# EasyEDA Pro project intellectual_roaddeng.eprj

# Schematic Schematic1
Create Date: 2025-08-11; Page Name: P1; Project Name: intellectual_roaddeng; Schematic Name: Schematic1; Update Date: 2025-09-09; Company: 嘉立创EDA; Page Size: A4; Version: V1.0
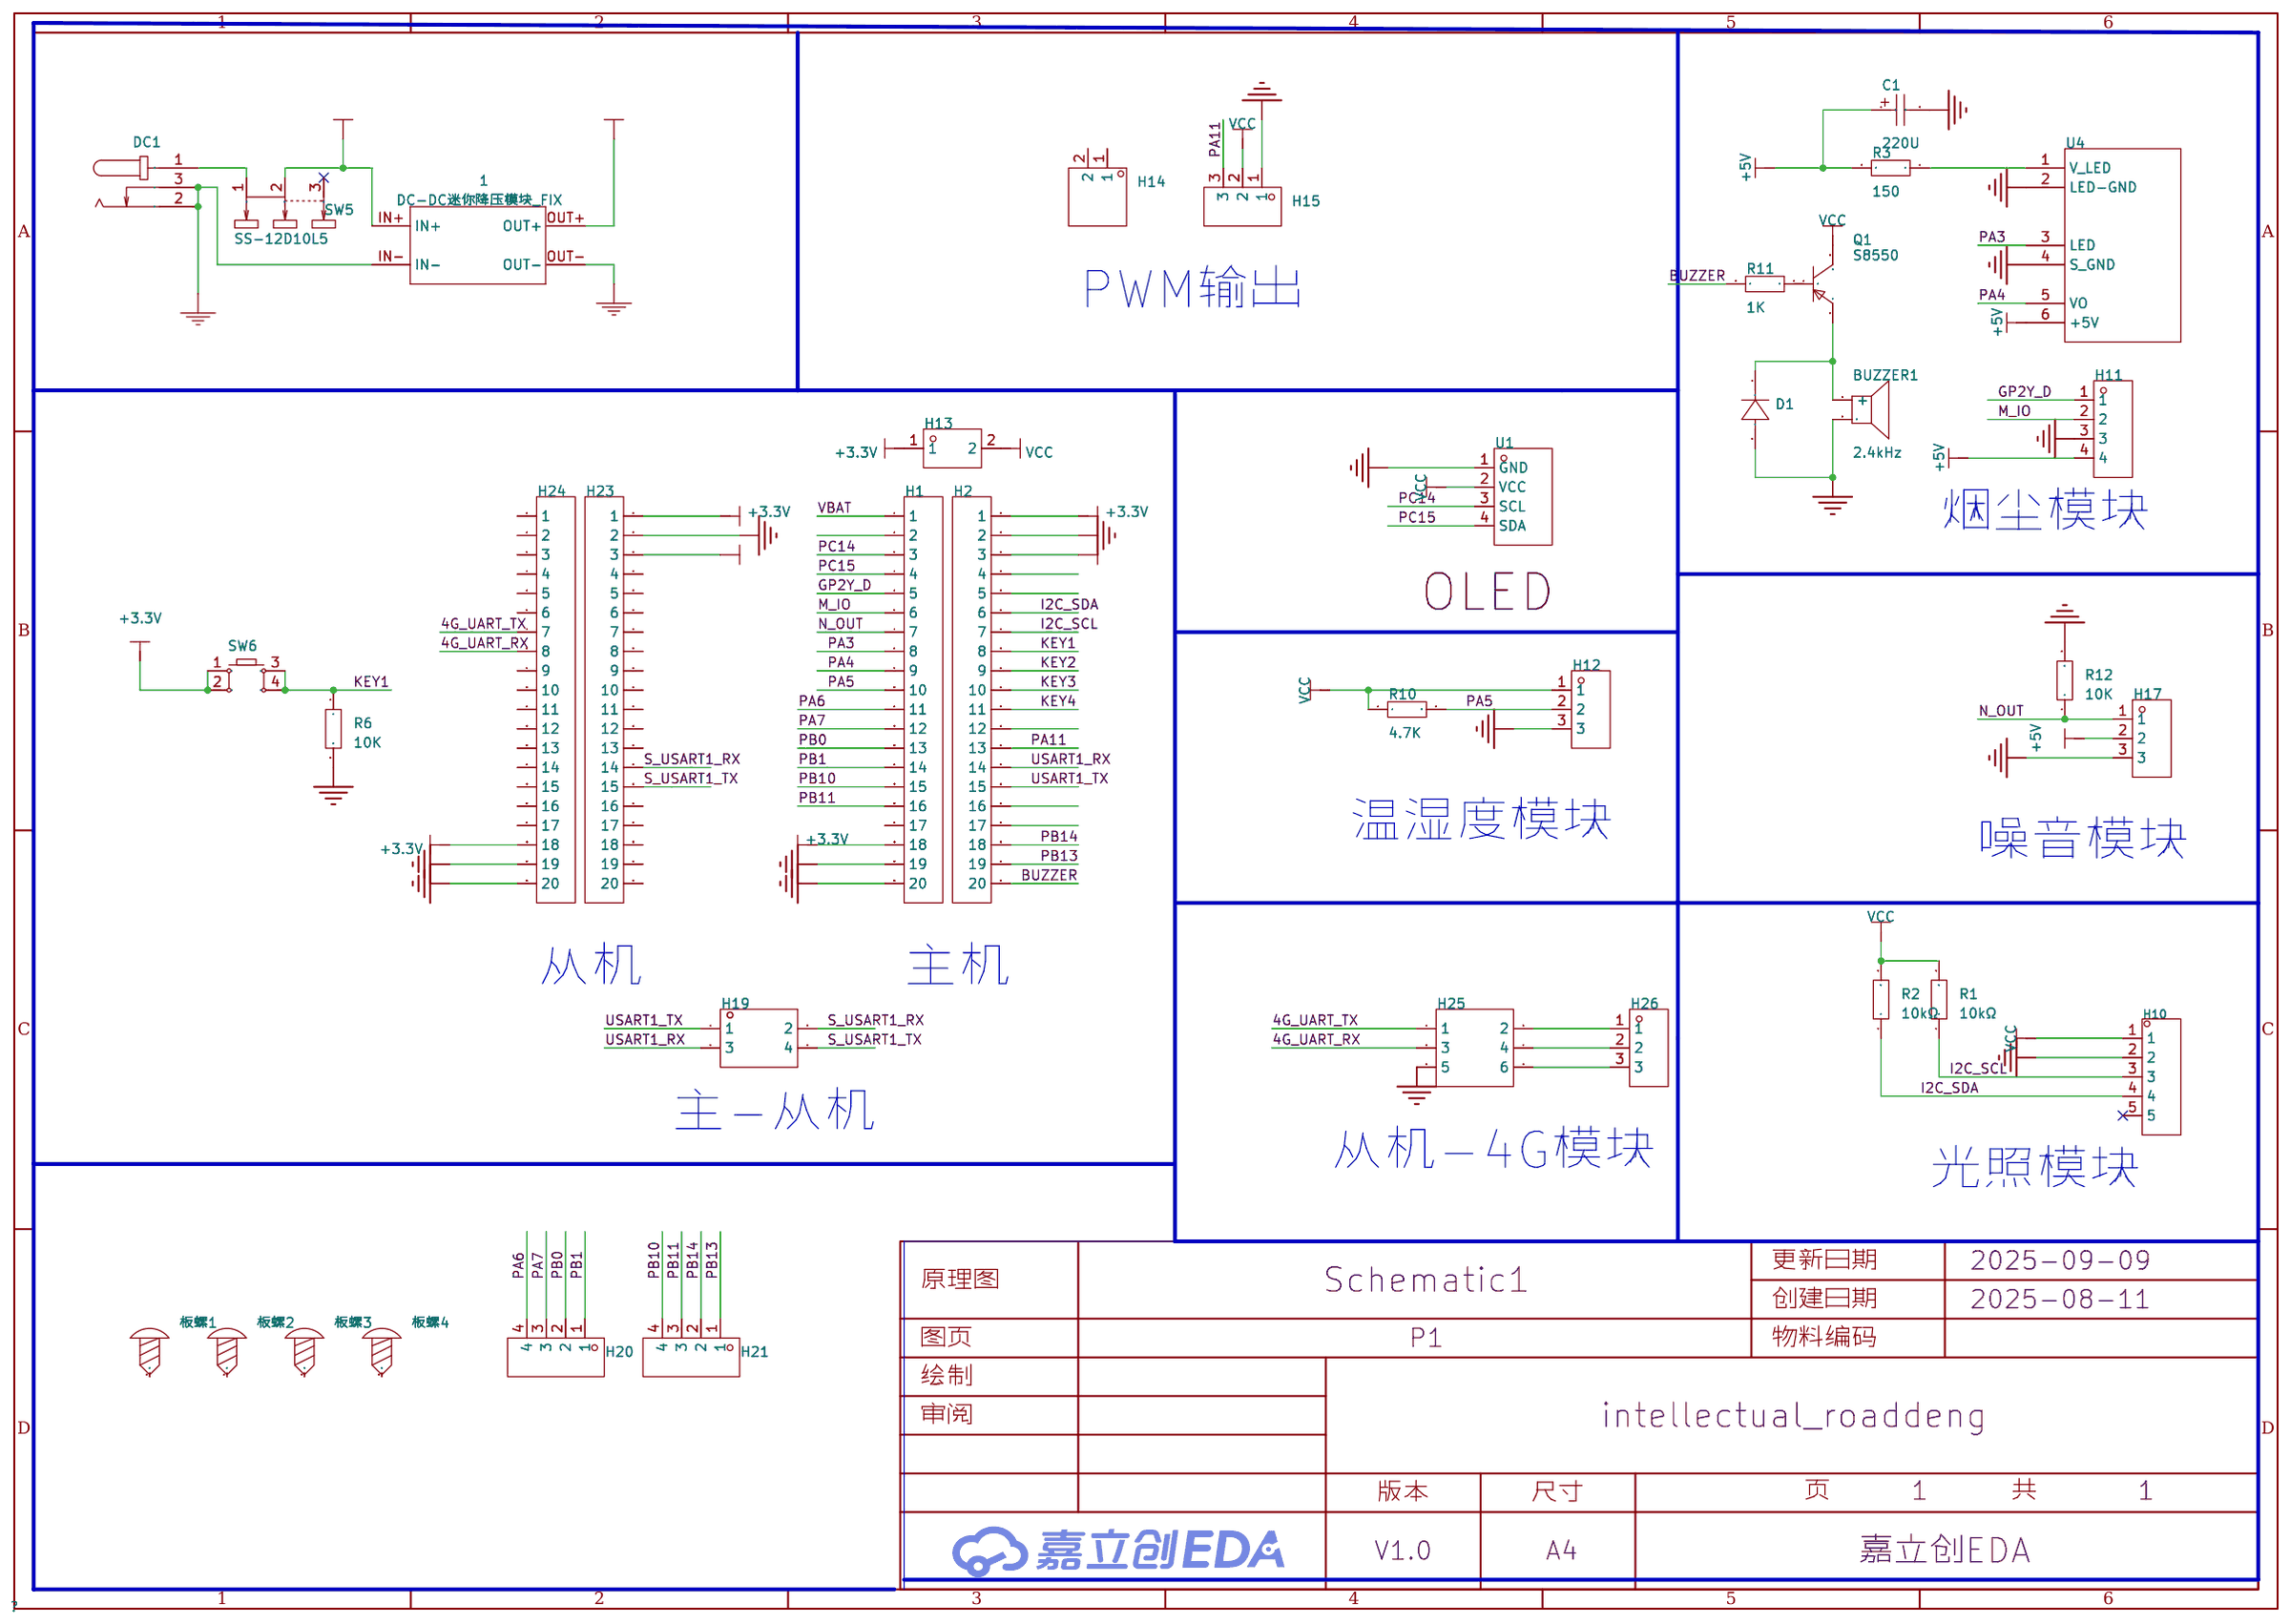
[diagram p0: schematic sheet]

## Parts
1  DC-DC迷你降压模块_FIX  [footprint_78bd]
BUZZER1  2.4kHz  [BUZ-TH_BD12.0-P7.60-D0.6-FD]
C1  220U  [CAP-TH-R3.51]
D1  -  [DO_1N4007]
DC1  DC005_C431533  [footprint_5569]
H1  HDR-F-2.54_1x20  [footprint_9e8e]
H2  HDR-F-2.54_1x20  [footprint_9e8e]
H10  -  [HDR-TH_5P-P2.54-V-M]
H11  -  [HDR-TH_4P-P2.54-V-F]
H12  -  [HDR-TH_3P-P2.54-V-F]
H13  -  [HDR-TH_2P-P2.54-V-M-2]
H14  -  [HDR-TH_2P-P2.54-V-M-1]
H15  -  [HDR-TH_3P-P2.54-V-M]
H17  -  [HDR-TH_3P-P2.54-V-F]
H19  -  [跳线帽连接器]
H20  -  [HDR-TH_4P-P2.54-V-F]
H21  -  [HDR-TH_4P-P2.54-V-F]
H23  HDR-F-2.54_1x20  [footprint_9e8e]
H24  HDR-F-2.54_1x20  [footprint_9e8e]
H25  -  [HDR-TH_6P-P2.54-V-F-R2-C3-S2.54]
H26  -  [HDR-TH_3P-P2.54-V-F]
Q1  S8550  [PNP-TH]
R1  10kΩ  [RES-TH_BD3.7-L10.7-P14.70-D0.4]
R2  10kΩ  [RES-TH_BD3.7-L10.7-P14.70-D0.4]
R3  150  [RES-TH_BD3.7-L10.7-P14.70-D0.4]
R6  10K  [RES-TH_BD3.7-L10.7-P14.70-D0.4]
R10  4.7K  [RES-TH_BD3.7-L10.7-P14.70-D0.4]
R11  1K  [RES-TH_BD3.7-L10.7-P14.70-D0.4]
R12  10K  [R0603]
SW5  SS-12D10L5  [footprint_fc91]
SW6  -  [KEY-TH]
U1  OLED  [OLED-TH_L27.8-W27.2-P2.54_C9900033791]
U4  -  [MX1.25-6P]
板螺1  -  [M2螺丝]
板螺2  -  [M2螺丝]
板螺3  -  [M2螺丝]
板螺4  -  [M2螺丝]

## Library data of the parts
1 = DC-DC迷你降压模块_FIX
BUZZER1 = TMB12A05_C96093: 驱动方式:有源(内含驱动线路);构造类型:电磁式;额定电压:-;频率:2.4kHz;声压(SPL):85dB;; LCSC Part Name: TMB12A05; Supplier Part: C96093; Manufacturer: 华能; Manufacturer Part: TMB12A05; Supplier Footprint: 插件,D=12mm; Datasheet: https://atta.szlcsc.com/upload/public/pdf/source/20241025/8A17FE04D767D19A35A06DEF9A82AB1E.pdf; Supplier: LCSC; Driver Circuitry: 有源(内含驱动线路); Technology: 电磁式; Voltage - Supply: 4V~8V; Sound Pressure Level(SPL): 85dB; Diameter(φD): 12mm; Height: 9.8mm
C1 = C_Ele_SMD_3x5.4mm: Supplier Footprint: SMD,3x5.4mm
D1 = D_1N4007A: Supplier Footprint: DO-41
DC1 = DC005_C431533: Supplier: LCSC; Supplier Part: C431533; Manufacturer: SHOU HAN; Manufacturer Part: DC005; JLCPCB Part Class: Extended Part
H1 H2 H23 H24 = HDR-F-2.54_1x20: Supplier Part: C50984; Supplier: LCSC; Manufacturer: BOOMELE; Manufacturer Part: 2.54mm 1*20P Female header
H10 = HDR-M_2.54_1x5P: Supplier Part: C358687; Supplier Footprint: 插件
H11 H20 H21 = HDR-F_2.54_1x4P: Supplier Part: C2718488; Supplier Footprint: 插件
H12 H17 H26 = HDR-F_2.54_1x3P: Supplier Part: C541850; Supplier Footprint: 插件
H13 = HDR-M_2.54_2x1: Supplier Part: C2883961; Supplier Footprint: 插件,P=2.54mm
H14 = HDR-M_2.54_1x2P: Supplier Part: C124375; Supplier Footprint: 插件
H15 = HDR-M_2.54_1x3P: Supplier Part: C2937625; Supplier Footprint: 插件
H19 = HDR-F_2.54_2x2: Supplier Part: C92273; Supplier Footprint: 插件
H25 = HDR-F_2.54_2x3: Supplier Part: C92272; Supplier Footprint: 插件
Q1 = S8550_C20069126: 晶体管类型:PNP;集电极电流(Ic):500mA;集射极击穿电压(Vceo):25V;耗散功率(Pd):300mW;直流电流增益(hFE):120@500mA,1.0V;; LCSC Part Name: hFE:200-350，丝印:2TY S8550; Supplier Part: C20069126; Manufacturer: 宏嘉诚; Supplier Footprint: SOT-23; Datasheet: https://atta.szlcsc.com/upload/public/pdf/source/20250107/6DAD7E9AA702AA129A4A0106BAAB5F5A.pdf; Supplier: LCSC; type: PNP; Current - Collector(Ic): 500mA; Collector - Emitter Voltage VCEO: 25V; Pd - Power Dissipation: 300mW; DC Current Gain: 120@500mA,1.0V; Transition frequency(fT): 150MHz; Current - Collector Cutoff: 100nA; Vce Saturation(VCE(sat)): 500mV; Operating Temperature: -55℃~+150℃
R1 R2 = Res_AXIAL-1/8W: Supplier Footprint: 轴向引线
R3 R6 R10-R12 = Res_0603: Supplier Footprint: 0603
SW5 = SS-12D10L5: Supplier: LCSC; Supplier Part: C319012; Manufacturer: XKB Enterprise; JLCPCB Part Class: Extended Part
SW6 = Key_SMD_12x12x7.3: Supplier Footprint: SMD
U1 = HS96L03W2C03: 主控芯片:SSD1315;接口类型:I2C;尺寸(inch):0.96;像素分辨率:128x64;; LCSC Part Name: 0.96寸OLED显示屏窄白光IIC; Supplier Part: C5248080; Manufacturer: HS(汉昇); Datasheet: https://atta.szlcsc.com/upload/public/pdf/source/20230627/763D01F79A90007632F098068C7C8AD9.pdf; Supplier: LCSC; Main Control Chip: SSD1315; Interface Type: I2C; Size: 0.96; Pixel Resolution: 128x64; Operating Temperature: -40℃~+70℃
U4 = GP2Y1014
板螺1-板螺4 = M2螺丝: Supplier Footprint: 插件

## Nets
+3.3V: H1.18 H2.1 H13.1 H23.1 H24.18 SW6.1 SW6.2
+5V: 1.OUT+ C1.1 H2.3 H11.4 H17.2 H23.3 R3.2 U4.6(+5V)
GND: 1.IN- 1.OUT- BUZZER1.2 C1.2 D1.2(A) DC1.2 DC1.3 H1.19 H1.20 H2.2 H10.2 H11.3 H12.3 H15.1 H17.3 H23.2 H24.19 H24.20 H25.5 R6.2 R12.2 U1.1(GND) U4.2(LED-GND) U4.4(S_GND)
VBAT: H1.1
VBAT_IN: 1.IN+ SW5.2
VCC: H10.1 H12.1 H13.2 H15.2 Q1.3(C) R1.2 R2.2 R10.1 U1.2(VCC)
4G_UART_RX: H24.8 H25.3
4G_UART_TX: H24.7 H25.1
BUZZER: H2.20 R11.2
GP2Y_D: H1.5 H11.1
I2C_SCL: H2.7 H10.3 R1.1
I2C_SDA: H2.6 H10.4 R2.1
KEY1: H2.8 R6.1 SW6.3 SW6.4
KEY2: H2.9
KEY3: H2.10
KEY4: H2.11
M_IO: H1.6 H11.2
N_OUT: H1.7 H17.1 R12.1
PA3: H1.8 U4.3(LED)
PA4: H1.9 U4.5(VO)
PA5: H1.10 H12.2 R10.2
PA6: H1.11 H20.4
PA7: H1.12 H20.3
PA11: H2.13 H15.3
PB0: H1.13 H20.2
PB1: H1.14 H20.1
PB10: H1.15 H21.4
PB11: H1.16 H21.3
PB13: H2.19 H21.1
PB14: H2.18 H21.2
PC14: H1.3 U1.3(SCL)
PC15: H1.4 U1.4(SDA)
S_USART1_RX: H19.2 H23.14
S_USART1_TX: H19.4 H23.15
USART1_RX: H2.14 H19.3
USART1_TX: H2.15 H19.1
$1N472: DC1.1 SW5.1
$1N3550: R3.1 U4.1(V_LED)
$1N3959: BUZZER1.1(+) D1.1(K) Q1.2(E)
$1N3998: Q1.1(B) R11.1
$1N9228: H25.2 H26.1
$1N9231: H25.4 H26.2
$1N9234: H25.6 H26.3

Not connected (* = marked no-connect by the designer): H1 2 17; H2 4 5 12 16 17; H10 5*; H14 1 2; H23 4 5 6 7 8 9 10 11 12 13 16 17 18 19 20; H24 1 2 3 4 5 6 9 10 11 12 13 14 15 16 17; SW5 3*; 板螺1 1; 板螺2 1; 板螺3 1; 板螺4 1

## Notes on the sheet
- PWM输出
- 烟尘模块
- 温湿度模块
- 噪音模块
- 从机
- 主机
- 主-从机
- 从机-4G模块
- 光照模块

# Board PCB1
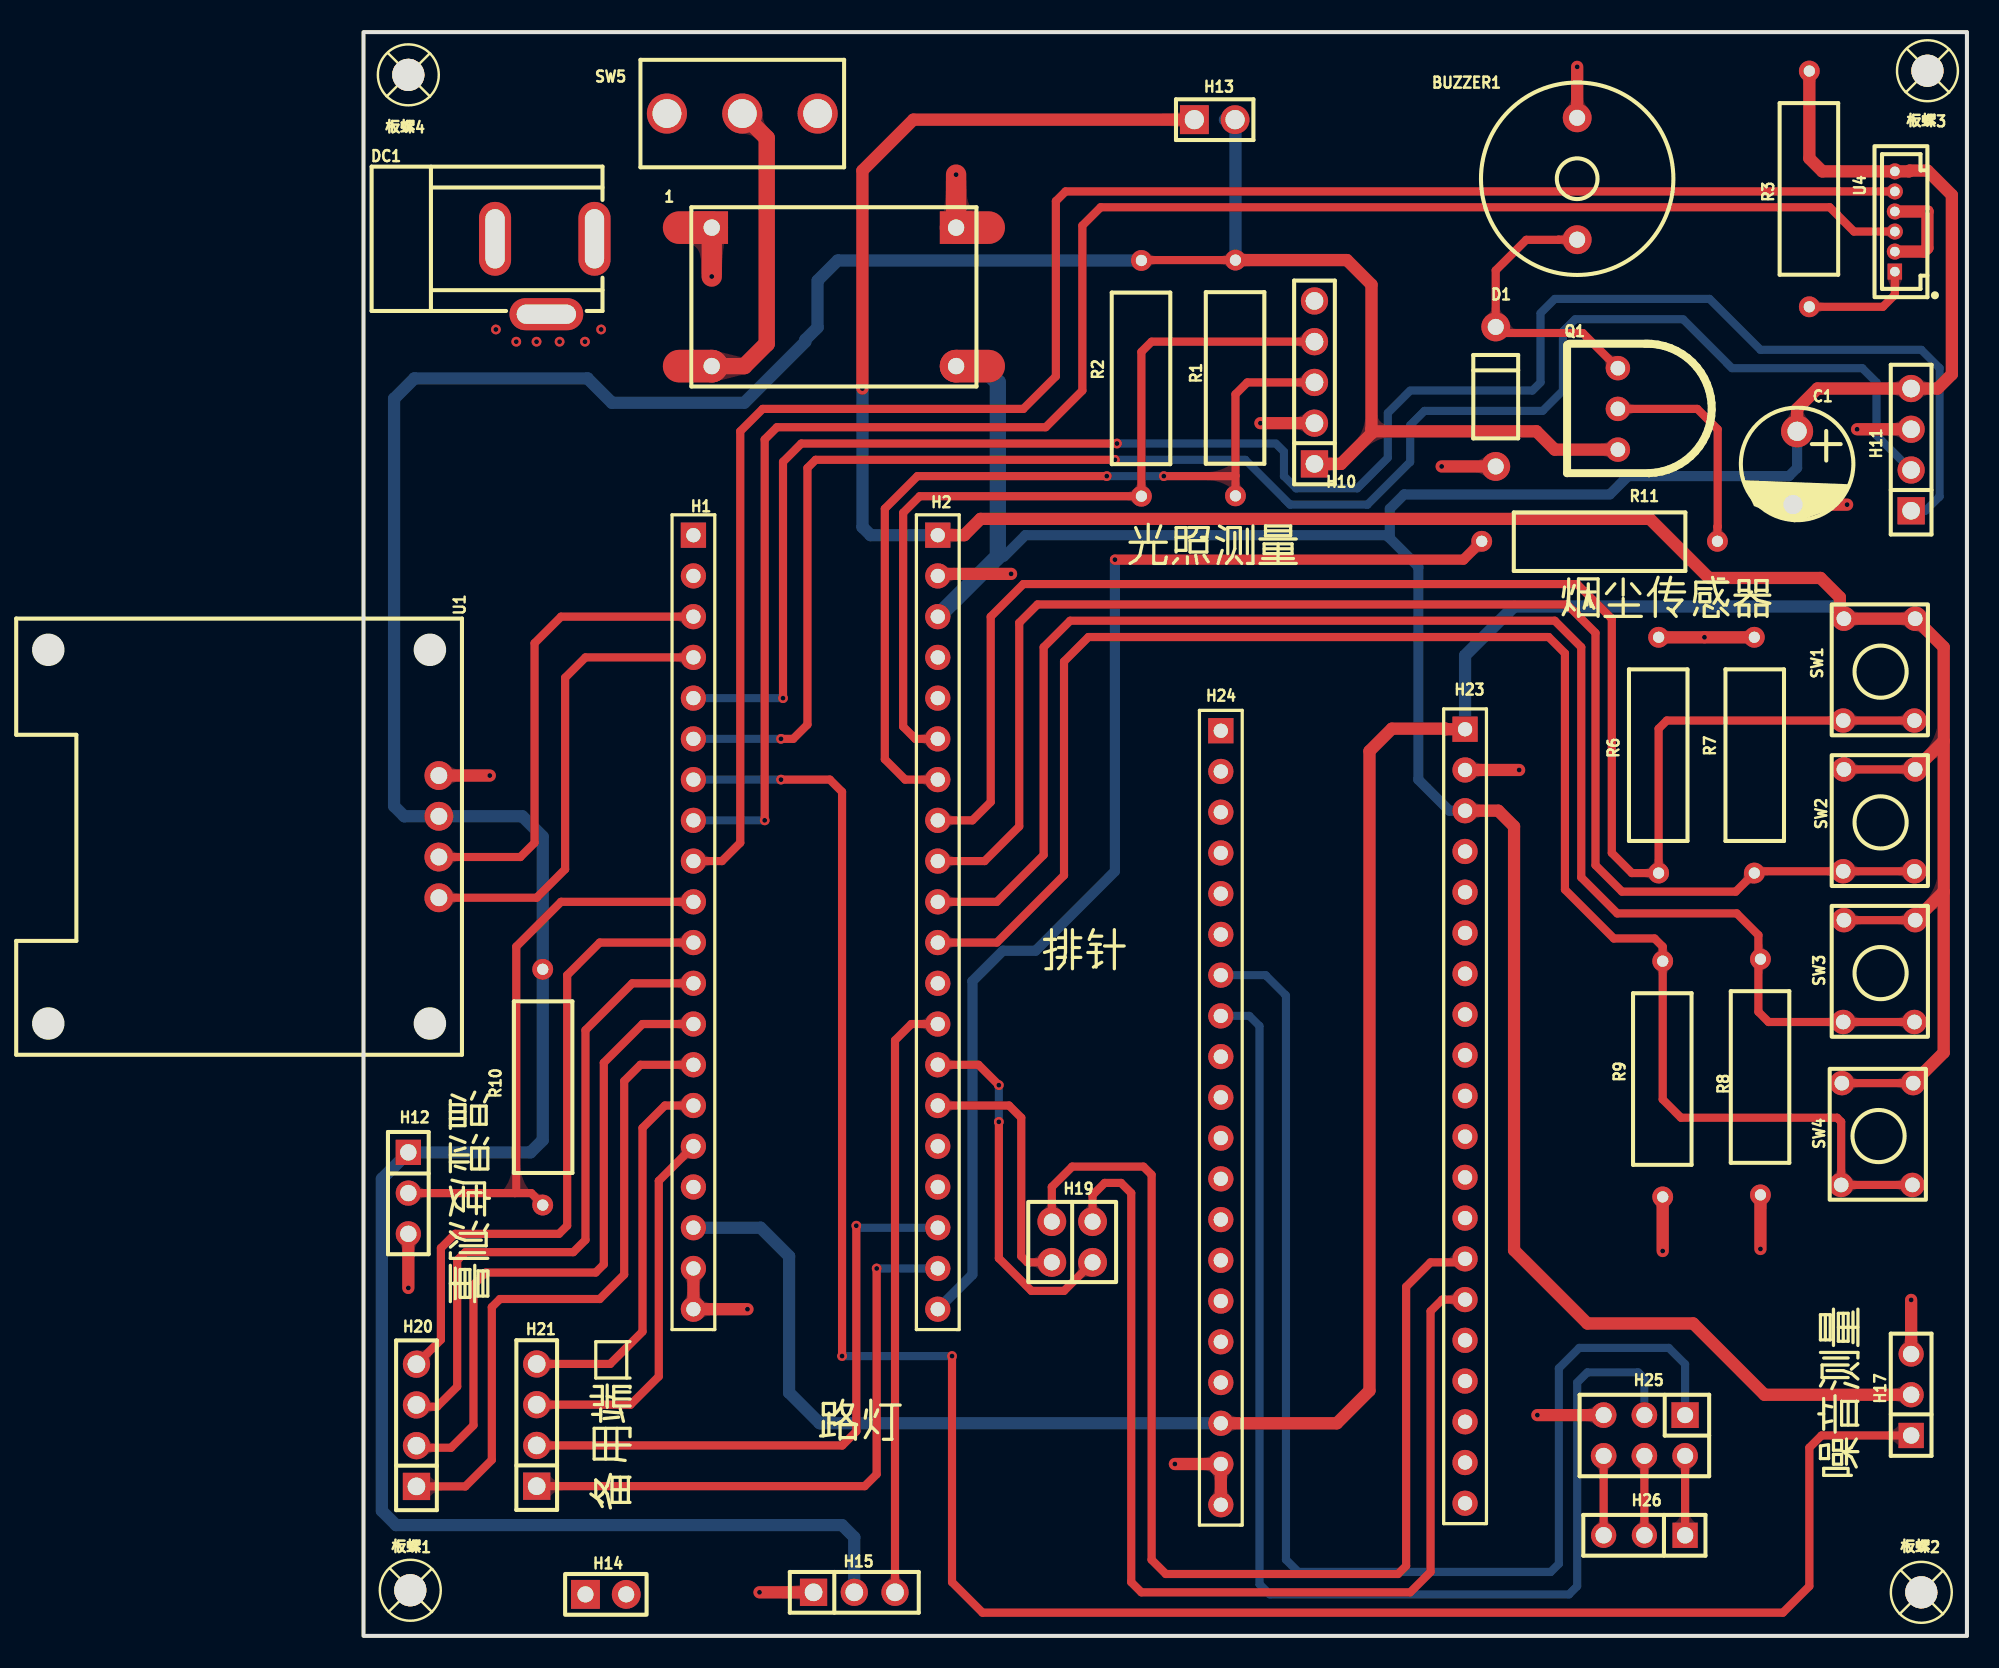
[diagram p1: board, top side]
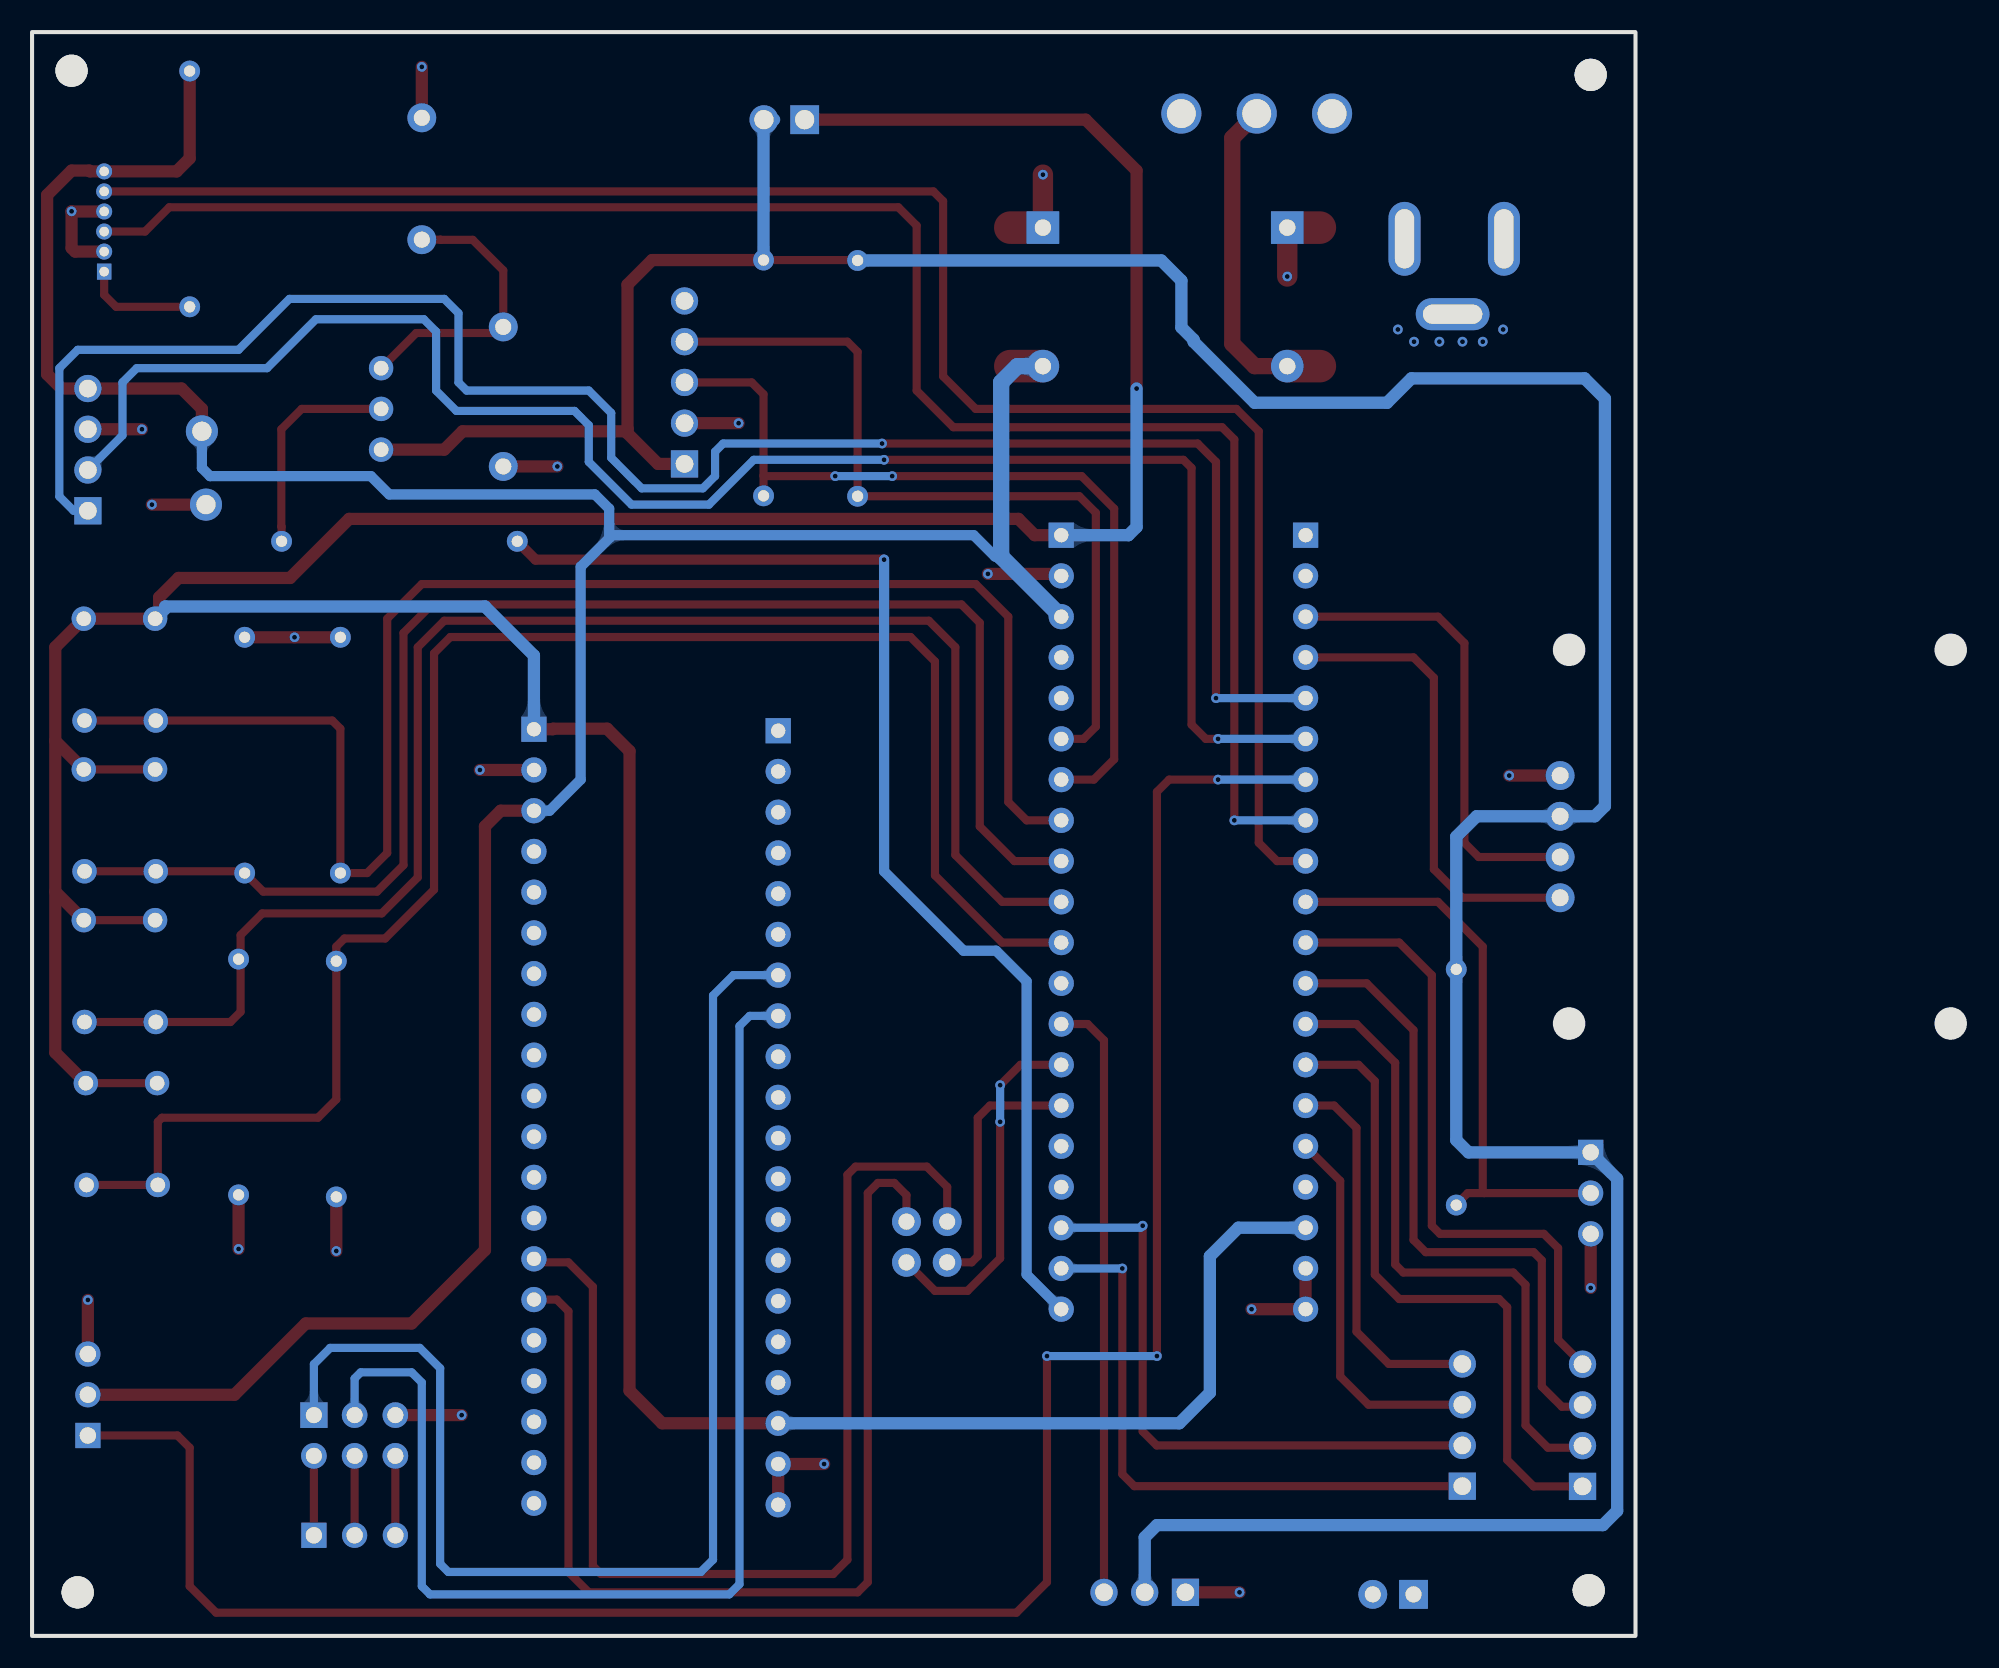
[diagram p2: board, bottom side, seen from below]

Outline 120.67 x 100 mm; copper layers: Top Layer, Bottom Layer. Coordinates in mm from the lower left corner of the outline.
Outline path: rectangle 20.67,100 120.67,0
Stack: Top Layer 0.035mm / Dielectric1 1.51mm FR4 er 4.5 / Bottom Layer 0.035mm

## Design rules (mm)
template: 自定义配置
spacing copperThickness1oz (default): track to track 0.254, other pairs 0.124 to 0.3
spacing copperThickness2oz: track to track 0.203, other pairs 0.152 to 0.3
track width copperThickness1oz (default): min 0.254, default 0.508, max 1.27
track width copperThickness2oz: min 0.203, default 0.254, max 2.54
differential pair differentialPair (default): width min 0.127, default 0.254, max 2.54; gap min 0.152, default 0.152
via viaSize (default): diameter min 0.5, default 0.61, max 10; hole min 0.3, default 0.305, max 6.299
net GND uses copperRegion1
net $1N472 uses copperRegion1

## Placement (name value [footprint] x y rotation side)
1  DC-DC迷你降压模块_FIX  [footprint_78bd]  41.88 77.9 0 top
BUZZER1  2.4kHz  [BUZ-TH_BD12.0-P7.60-D0.6-FD]  96.36 90.86 90 top
C1  220U  [CAP-TH-R3.51]  110.08 73.08 270 top
D1  -  [DO_1N4007]  91.28 77.27 270 top
DC1  DC005_C431533  [footprint_5569]  31.98 84.76 0 top
H1  HDR-F-2.54_1x20  [footprint_9e8e]  41.25 44.5 270 top
H2  HDR-F-2.54_1x20  [footprint_9e8e]  56.49 44.5 270 top
H10  -  [HDR-TH_5P-P2.54-V-M]  79.98 78.16 90 top
H11  -  [HDR-TH_4P-P2.54-V-F]  117.19 73.97 90 top
H12  -  [HDR-TH_3P-P2.54-V-F]  23.47 27.61 270 top
H13  -  [HDR-TH_2P-P2.54-V-M-2]  73.76 94.54 270 top
H14  -  [HDR-TH_2P-P2.54-V-M-1]  35.79 2.59 0 top
H15  -  [HDR-TH_3P-P2.54-V-M]  51.28 2.72 0 top
H17  -  [HDR-TH_3P-P2.54-V-F]  117.19 15.04 90 top
H19  -  [跳线帽连接器]  63.6 25.83 0 top
H20  -  [HDR-TH_4P-P2.54-V-F]  23.97 13.13 90 top
H21  -  [HDR-TH_4P-P2.54-V-F]  31.47 13.15 90 top
H23  HDR-F-2.54_1x20  [footprint_9e8e]  89.37 32.4 270 top
H24  HDR-F-2.54_1x20  [footprint_9e8e]  74.14 32.31 270 top
H25  -  [HDR-TH_6P-P2.54-V-F-R2-C3-S2.54]  100.56 12.5 180 top
H26  -  [HDR-TH_3P-P2.54-V-F]  100.56 6.27 180 top
Q1  S8550  [PNP-TH]  95.6 76.51 0 top
R1  10kΩ  [RES-TH_BD3.7-L10.7-P14.70-D0.4]  75.05 78.43 90 top
R2  10kΩ  [RES-TH_BD3.7-L10.7-P14.70-D0.4]  69.19 78.41 90 top
R3  150  [RES-TH_BD3.7-L10.7-P14.70-D0.4]  110.84 90.22 90 top
R6  10K  [RES-TH_BD3.7-L10.7-P14.70-D0.4]  101.44 54.92 90 top
R7  10K  [RES-TH_BD3.7-L10.7-P14.70-D0.4]  107.41 54.92 270 top
R8  10K  [RES-TH_BD3.7-L10.7-P14.70-D0.4]  107.79 34.85 90 top
R9  10K  [RES-TH_BD3.7-L10.7-P14.70-D0.4]  101.7 34.72 90 top
R10  4.7K  [RES-TH_BD3.7-L10.7-P14.70-D0.4]  31.85 34.21 270 top
R11  1K  [RES-TH_BD3.7-L10.7-P14.70-D0.4]  97.76 68.25 180 top
SW1  -  [KEY-TH]  115.29 60.38 270 top
SW2  -  [KEY-TH]  115.29 50.98 270 top
SW3  -  [KEY-TH]  115.29 41.58 270 top
SW4  -  [KEY-TH]  115.16 31.42 270 top
SW5  SS-12D10L5  [footprint_fc91]  44.29 94.92 0 top
U1  OLED  [OLED-TH_L27.8-W27.2-P2.54_C9900033791]  25.37 49.84 270 top
U4  -  [MX1.25-6P]  116.18 88.19 90 top
板螺1  -  [M2螺丝]  23.59 2.85 0 top
板螺2  -  [M2螺丝]  117.83 2.72 0 top
板螺3  -  [M2螺丝]  118.21 97.59 0 top
板螺4  -  [M2螺丝]  23.47 97.33 0 top

## Footprints (pads in the part's own frame, mm; a bottom-side part is the same pattern mirrored in y, then rotated)
BUZ-TH_BD12.0-P7.60-D0.6-FD
  round 1.8 hole 1: 1(-3.8,0) 2(3.8,0)
CAP-TH-R3.51
  round 2 hole 1.2: 1(-2.032,0) 2(2.54,-0.254)
DO_1N4007
  round 1.8 hole 1: 1(-4.35,0) 2(4.35,0)
footprint_9e8e
  rect 1.575x1.575 hole 0.889: 1(-24.13,0)
  round 1.575 hole 0.889: 2(-21.59,0) 3(-19.05,0) 4(-16.51,0) 5(-13.97,0) 6(-11.43,0) 7(-8.89,0) 8(-6.35,0) 9(-3.81,0) 10(-1.27,0) 11(1.27,0) 12(3.81,0) 13(6.35,0) 14(8.89,0) 15(11.43,0) 16(13.97,0) 17(16.51,0) 18(19.05,0) 19(21.59,0) 20(24.13,0)
footprint_78bd
  rect 2.032x2.032 hole 1.016x1.021: 1(0.508,9.906) 3(15.748,9.906)
  round 2.032 hole 1.016x1.021: 2(0.508,1.27) 4(15.748,1.27)
  oval 4.064x2.032 smd: IN+(-0.508,1.27) IN-(-0.508,9.906) OUT+(16.764,1.27) OUT-(16.764,9.906)
footprint_5569
  oval 2x4.6 hole 1.2x3.7: 1(3.1,2.35) 2(-3.1,2.35)
  oval 4.6x2 hole 3.7x1.2: 3(0.1,-2.35)
footprint_fc91
  round 2.5 hole 1.8: 1(-4.7,0) 2(0,0) 3(4.7,0)
HDR-TH_2P-P2.54-V-M-1
  rect 1.8x1.8 hole 1: 1(-1.27,0)
  round 1.8 hole 1: 2(1.27,0)
HDR-TH_2P-P2.54-V-M-2
  rect 1.8x1.8 hole 1.2: 1(0,-1.27)
  round 1.8 hole 1.2: 2(0,1.27)
HDR-TH_3P-P2.54-V-F
  rect 1.575x1.575 hole 1.02: 1(-2.54,0)
  round 1.575 hole 1.02: 2(0,0) 3(2.54,0)
HDR-TH_3P-P2.54-V-M
  rect 1.7x1.7 hole 1.1: 1(-2.54,0)
  round 1.7 hole 1.1: 2(0,0) 3(2.54,0)
HDR-TH_4P-P2.54-V-F
  rect 1.7x1.7 hole 1.1: 1(-3.81,0)
  round 1.7 hole 1.1: 2(-1.27,0) 3(1.27,0) 4(3.81,0)
HDR-TH_5P-P2.54-V-M
  rect 1.7x1.7 hole 1.1: 1(-5.08,0)
  round 1.7 hole 1.1: 2(-2.54,0) 3(0,0) 4(2.54,0) 5(5.08,0)
HDR-TH_6P-P2.54-V-F-R2-C3-S2.54
  rect 1.7x1.6 hole 1: 1(-2.54,-1.27)
  round 1.6 hole 1: 2(-2.54,1.27) 3(0,-1.27) 4(0,1.27) 5(2.54,-1.27) 6(2.54,1.27)
KEY-TH
  round 1.524 hole 0.914: 1(-3.048,2.159) 2(-3.048,-2.286) 3(3.302,2.114) 4(3.302,-2.332)
M2螺丝
  round 2 hole 2: 1(0,0)
MX1.25-6P
  rect 1x0.9 hole 0.6: 1(-3.125,0)
  round 1 hole 0.6: 2(-1.875,0) 3(-0.625,0) 4(0.625,0) 5(1.875,0) 6(3.125,0)
OLED-TH_L27.8-W27.2-P2.54_C9900033791
  round 1.8 hole 1.05: 1(-3.81,0) 2(-1.27,0) 3(1.27,0) 4(3.81,0)
PNP-TH
  round 1.524 hole 0.914: 1(3.302,0) 2(3.302,2.54) 3(3.302,-2.54)
RES-TH_BD3.7-L10.7-P14.70-D0.4
  round 1.3 hole 0.7: 1(-7.35,0) 2(7.35,0)
跳线帽连接器
  round 1.8 hole 1: 1(0,-2.54) 2(0,0) 3(2.54,-2.54) 4(2.54,0)

## Nets
As in the schematic, except:
+3.3V: H1.18 H2.1 H13.1 H23.1 H24.18 SW1.1 SW1.2 SW2.1 SW2.2 SW3.1 SW3.2 SW4.1 SW4.2
+5V: 1.4 1.OUT+ C1.1 H2.3 H11.4 H17.2 H23.3 R3.2 U4.6
GND: 1.1 1.3 1.IN- 1.OUT- BUZZER1.2 C1.2 D1.2 DC1.2 DC1.3 H1.19 H1.20 H2.2 H10.2 H11.3 H12.3 H15.1 H17.3 H23.2 H24.19 H24.20 H25.5 R6.2 R7.1 R8.1 R9.1 U1.1 U4.2 U4.4
VBAT_IN: 1.2 1.IN+ SW5.2
KEY1: H2.8 R6.1 SW1.3 SW1.4
KEY2: H2.9 R7.2 SW2.3 SW2.4
KEY3: H2.10 R8.2 SW3.3 SW3.4
KEY4: H2.11 R9.2 SW4.3 SW4.4

Pads without a net: H1 17; H10 5; H14 1 2; H23 4 5 6 7 8 9 10 11 12 13 16 17 18 19 20; H24 1 2 3 4 5 6 9 10 11 12 13 14 15 16 17; SW5 3; 板螺1 1; 板螺2 1; 板螺3 1; 板螺4 1

## Via types
v1: diameter 0.61, hole 0.305, Top Layer to Bottom Layer, 42 vias

## Routing (per net, layer and track width the routed paths; a pad name or vN(x,y) marks a point on that pad's centre or on a via; arc(x,y) is an arc through that point)
+3.3V: length 291.9
  Top Layer w0.508: SW3.2 SW3.1 ; SW4.2 SW4.1 ; SW2.2 SW2.1
  Top Layer w0.762: H2.1 58.14,68.63 59.15,69.65 100.9,69.65 104.58,65.96 111.54,65.96 112.75,64.76 112.75,63.68 SW1.2 SW1.1 119.22,61.65 119.22,55.8 ; SW4.1 119.22,36.37 119.22,46.41 ; 119.22,46.41 SW3.1 ; 119.22,46.41 119.22,55.8 ; H24.18 81.38,13.26 83.41,15.29 83.41,55.17 84.81,56.57 88.17,56.57 88.2,56.53 H23.1 ; 119.22,55.8 SW2.1 ; v1(51.79,77.78) 51.79,91.36 54.96,94.54 H13.1
  Bottom Layer w0.762: H1.18 45.44,25.45 47.22,23.67 47.22,15.16 49.12,13.26 H24.18 ; H23.1 89.37,61.13 92.43,64.19 112.37,64.19 112.37,64.06 SW1.2 ; v1(51.79,77.78) 51.79,69.14 52.3,68.63 H2.1
+5V: length 191.1
  Top Layer w0.762: H23.3 91.45,51.45 92.43,50.47 92.43,24.05 97,19.48 103.6,19.48 108.05,15.04 H17.2 ; C1.1 110.08,76.51 111.35,77.78 H11.4 118.84,77.78 119.73,78.66 119.73,89.84 118.21,91.36 117.11,91.36 117.06,91.31 U4.6 111.65,91.31 110.84,92.13 R3.2
  Bottom Layer w0.635: 60.23,67.3 60.61,67.3 61.95,68.63 84.49,68.63 84.64,68.48 ; 84.64,68.48 86.46,66.66 86.46,53.39 88.4,51.45 H23.3 ; 84.64,68.48 84.68,68.52 84.68,70.28 85.57,71.17 98.4,71.17 99.54,72.31 109.57,72.31 110.08,72.82 C1.1
  Bottom Layer w1.016: 1.4 59.22,79.17 60.23,78.16 60.23,67.3 H2.3
GND: length 76.9
  Top Layer w0.762: 89.57,53.99 v1(92.74,53.99) ; 110.02,70.54 v1(113.2,70.54) ; U1.1 v1(28.55,53.65) ; 91.09,72.92 v1(87.91,72.92) ; 41.44,20.37 v1(44.62,20.37) ; H1.19 H1.20 ; H25.5 v1(93.88,13.77) ; BUZZER1.2 v1(96.36,97.83) ; U4.2 117.98,86.31 118.21,86.54 118.21,88.81 ; 48.54,2.72 v1(45.37,2.72) ; U4.4 118.21,88.81 ; 118.21,88.81 v1(118.21,88.82) ; 107.79,27.3 v1(107.79,24.13) ; 23.47,24.87 v1(23.47,21.7) ; v1(61.06,66.22) 56.81,66.22 56.68,66.09 ; 74.45,10.72 v1(71.28,10.72) ; R6.2 v1(104.3,62.27) 107.48,62.27 ; 79.78,75.62 v1(76.61,75.62) ; 101.7,27.18 v1(101.7,24) ; 117,75.24 v1(113.82,75.24) ; H24.20 H24.19 ; 117.19,17.77 v1(117.19,20.95)
  Top Layer w1.27: 1.3 v1(57.63,91.11) ; 1.1 v1(42.39,84.76)
  vias: v1(28.93,81.46) v1(30.2,80.7) v1(31.46,80.7) v1(32.9,80.7) v1(34.48,80.7) v1(35.49,81.46)
VBAT_IN: length 19
  Top Layer w1.016: 1.2 44.42,79.17 45.82,80.57 45.82,93.4 SW5.2
VCC: length 226.6
  Top Layer w0.508: R2.2 69.21,85.78 R1.2
  Top Layer w0.762: 83.54,75.27 83.54,74.98 81.63,73.08 H10.1 ; 83.54,75.27 83.7,75.11 93.82,75.11 94.97,73.97 Q1.3 ; 83.54,75.27 83.54,84.25 82,85.78 R1.2
  Bottom Layer w0.762: R1.2 75.05,94.13 74.65,94.54 74.39,94.54 ; R2.2 50.25,85.76 48.99,84.51 48.99,81.59 48.23,80.82 48.23,80.7 44.42,76.89 36.17,76.89 34.64,78.41 23.85,78.41 22.58,77.14 22.58,51.74 23.21,51.11 U1.2 30.58,51.11 31.85,49.84 R10.1 31.85,30.91 31.09,30.15 H12.1 21.82,28.5 21.82,7.8 22.7,6.91 50.52,6.91 51.28,6.15 H15.2
4G_UART_RX: length 77.4
  Bottom Layer w0.508: H24.8 75.92,38.66 76.55,38.02 76.55,3.23 77.19,2.59 95.86,2.59 96.36,3.1 96.36,15.8 97,16.43 100.17,16.43 100.56,16.05 H25.3
4G_UART_TX: length 81.5
  Bottom Layer w0.508: H24.7 76.93,41.2 78.2,39.93 78.2,4.75 78.97,3.99 94.71,3.99 95.22,4.5 95.22,16.69 96.49,17.96 102.08,17.96 103.1,16.94 H25.1
BUZZER: length 75.9
  Top Layer w0.635: R11.2 89.27,67.11 v1(67.54,67.11)
  Bottom Layer w0.635: v1(67.54,67.11) 67.54,47.68 62.58,42.72 60.55,42.72 58.65,40.82 58.65,22.53 H2.20
GP2Y_D: length 116
  Top Layer w0.508: v1(67.66,74.35) 47.98,74.35 46.83,73.2 v1(46.83,58.47)
  Bottom Layer w0.508: H1.5 v1(46.83,58.47) ; H11.1 118.08,70.16 118.97,71.04 118.97,79.05 117.83,80.19 107.79,80.19 104.62,83.36 94.97,83.36 94.08,82.47 94.08,78.16 93.57,77.65 85.95,77.65 84.55,76.25 84.55,73.46 82.65,71.55 78.84,71.55 78.08,72.31 78.08,73.84 77.57,74.35 v1(67.66,74.35)
I2C_SCL: length 53.7
  Top Layer w0.508: 75.05,72.34 75.05,77.42 75.79,78.16 H10.3 ; 75.05,72.34 75.03,72.31 v1(70.58,72.31) ; 75.05,72.34 R1.1 ; H2.7 54.45,53.39 53.18,54.66 53.18,70.28 55.22,72.31 v1(67.03,72.31)
  Bottom Layer w0.508: v1(67.03,72.31) v1(70.58,72.31)
I2C_SDA: length 51.2
  Top Layer w0.508: H2.6 55.09,55.93 54.33,56.69 54.33,70.03 55.36,71.06 R2.1 69.19,80.06 69.82,80.7 H10.4
KEY1: length 99
  Top Layer w0.508: SW1.3 SW1.4 101.95,57.07 101.44,56.57 R6.1 99.78,47.57 98.52,48.82 98.52,63.42 96.36,65.58 61.82,65.58 59.79,63.55 59.79,51.99 58.65,50.85 56.49,50.85
KEY2: length 91.4
  Top Layer w0.508: SW2.3 SW2.4 107.52,47.68 R7.2 106.25,46.41 99.16,46.41 97.51,48.06 97.51,62.54 95.73,64.31 62.71,64.31 61.57,63.17 61.57,50.47 59.41,48.31 H2.9
KEY3: length 97.3
  Top Layer w0.508: H2.10 60.17,45.77 63.09,48.69 63.09,61.65 64.74,63.3 94.97,63.3 96.62,61.65 96.62,47.3 98.86,45.05 106.31,45.05 107.67,43.7 107.67,38.91 108.3,38.28 SW3.4 SW3.3
KEY4: length 107.2
  Top Layer w0.508: H2.11 60.17,43.23 64.36,47.42 64.36,60.76 65.88,62.28 94.59,62.28 95.6,61.27 95.6,46.53 98.65,43.49 101.19,43.49 101.7,42.98 R9.2 101.7,33.45 102.84,32.31 112.57,32.31 112.83,32.06 SW4.4 SW4.3
M_IO: length 107.8
  Top Layer w0.508: v1(67.54,73.33) 48.87,73.33 48.36,72.82 48.36,56.82 47.47,55.93 v1(46.71,55.93)
  Bottom Layer w0.508: H11.2 115.03,74.85 115.03,78.16 114.14,79.05 106.02,79.05 102.97,82.09 96.24,82.09 95.48,81.33 95.48,77.65 94.21,76.38 86.84,76.38 85.95,75.49 85.95,73.2 83.28,70.54 78.46,70.54 75.66,73.33 v1(67.54,73.33) ; H1.6 v1(46.71,55.93)
N_OUT: length 136
  Top Layer w0.508: v1(46.71,53.39) 49.76,53.39 50.52,52.63 v1(50.52,17.45) ; H17.1 111.6,12.5 110.84,11.74 110.84,3.1 109.19,1.45 59.28,1.45 57.38,3.35 v1(57.38,17.45)
  Bottom Layer w0.508: v1(57.38,17.45) v1(50.52,17.45) ; v1(46.71,53.39) H1.7
PA3: length 111.3
  Top Layer w0.508: v1(45.69,50.85) 45.69,74.6 46.45,75.36 63.22,75.36 65.5,77.65 65.5,87.94 66.65,89.08 112.11,89.08 113.63,87.56 U4.3
  Bottom Layer w0.508: v1(45.69,50.85) 41.25,50.85
PA4: length 113.7
  Top Layer w0.508: H1.9 43.02,48.31 44.17,49.45 44.17,75.11 45.56,76.51 61.82,76.51 63.85,78.54 63.85,89.46 64.46,90.06 U4.5
PA5: length 36.3
  Top Layer w0.508: 30.11,27.61 30.2,27.7 30.2,42.98 32.99,45.77 H1.10 ; 30.11,27.61 H12.2 ; 30.11,27.61 31.13,27.61 31.86,26.88 R10.2
PA6: length 40.8
  Top Layer w0.508: H1.11 35.4,43.23 33.37,41.2 33.37,25.58 32.86,25.07 26.39,25.07 25.5,24.18 25.5,18.47 H20.4 23.86,16.83
PA7: length 40.5
  Top Layer w0.508: H20.3 24.09,14.29 25.26,14.29 26.51,15.55 26.51,23.42 27.02,23.93 33.75,23.93 34.52,24.69 34.52,37.77 37.44,40.69 H1.12
PA11: length 37.5
  Top Layer w0.508: H2.13 54.84,38.15 53.82,37.14 H15.3
PB0: length 41.9
  Top Layer w0.508: H20.2 23.46,11.86 23.46,11.74 26.13,11.74 27.53,13.13 27.53,21.9 28.29,22.66 35.15,22.66 35.66,23.17 35.66,35.74 38.07,38.15 H1.13
PB1: length 41.4
  Top Layer w0.508: 23.43,9.32 H20.1 27.02,9.32 28.67,10.97 28.67,20.5 29.18,21.01 35.4,21.01 36.93,22.53 36.93,34.6 37.94,35.61 H1.14
PB10: length 23.9
  Top Layer w0.508: 41.25,33.07 39.47,33.07 38.07,31.67 38.07,18.97 36.05,16.96 31.47,16.96
PB11: length 23.6
  Top Layer w0.508: 31.47,14.42 37.32,14.42 39.09,16.18 39.09,28.37 H1.16
PB13: length 38.1
  Top Layer w0.508: v1(52.68,22.91) 52.68,10.08 51.93,9.34 H21.1
  Bottom Layer w0.508: v1(52.68,22.91) H2.19
PB14: length 38.3
  Top Layer w0.508: v1(51.41,25.58) 51.41,12.75 50.53,11.88 H21.2
  Bottom Layer w0.508: v1(51.41,25.58) 51.53,25.45 H2.18
PC14: length 29.4
  Top Layer w0.508: H1.3 32.99,63.55 31.34,61.9 31.34,49.45 30.45,48.57 U1.3
PC15: length 29.1
  Top Layer w0.508: H1.4 34.52,61.01 33.25,59.74 33.25,47.8 31.47,46.03 U1.4
S_USART1_RX: length 71.4
  Top Layer w0.508: H23.14 89.15,23.29 87.22,23.29 85.7,21.77 85.7,4.37 85.19,3.86 70.71,3.86 69.82,4.75 69.82,28.75 69.31,29.26 64.87,29.26 63.6,27.99 H19.2
S_USART1_TX: length 67.1
  Top Layer w0.508: H19.4 66.14,27.48 66.9,28.25 67.92,28.25 68.55,27.61 68.55,3.35 69.19,2.72 85.95,2.72 87.22,3.99 87.22,20.24 87.95,20.97 H23.15
USART1_RX: length 22.6
  Top Layer w0.508: v1(60.3,32.06) 60.3,23.55 62.33,21.51 64.36,21.51 H19.3 ; H2.14 59.03,35.61 v1(60.3,34.34)
  Bottom Layer w0.508: v1(60.3,32.06) v1(60.3,34.34)
USART1_TX: length 16.2
  Top Layer w0.508: H19.1 62.07,23.29 61.69,23.67 61.69,32.31 60.93,33.07 56.49,33.07
$1N3550: length 7.1
  Top Layer w0.508: U4.1 116.18,83.62 115.43,82.87 R3.1
$1N3959: length 18.3
  Top Layer w0.508: BUZZER1.1 95.21,87.06 95.2,87.05 93.19,87.05 91.28,85.14 91.28,81.24 96.71,81.24 98.9,79.05
$1N3998: length 13.7
  Top Layer w0.508: Q1.1 103.86,76.51 105.13,75.24 105.13,69.17 105.11,69.15 R11.1
$1N9228: length 5
  Top Layer w0.508: H25.2 H26.1
$1N9231: length 5
  Top Layer w0.508: H25.4 H26.2
$1N9234: length 5
  Top Layer w0.508: H25.6 H26.3

## Copper pours and planes (outline as drawn; the poured copper is in the pictures)
GND on Top Layer: 27.66,89.59 29.94,89.59 30.2,89.33 30.2,84.76 31.09,83.87 34.01,83.87 35.91,81.97 35.91,80.95 34.9,79.93 29.31,79.93 27.38,81.86 27.38,89.31
GND on Bottom Layer: -9.93,120.07 145.51,120.07 145.51,-22.17 -9.93,-22.17
$1N472 on Top Layer: 33.54,86.57 33.54,94.45 35.66,96.57 40.99,96.57 41.37,96.19 41.37,93.02 40.74,92.38 38.33,92.38 37.94,91.99 37.94,85.65 36.8,84.51 34.13,84.51 33.5,85.14 33.5,86.61

Small or netless copper shapes (teardrops, artwork), in the pictures only: 146 on Top Layer, 33 on Bottom Layer

## Text on the board
Top Silkscreen Layer: 路灯 | 烟尘传感器 | 备用端口 | 噪音测量 | 温湿度测量 | 排针 | 光照测量
